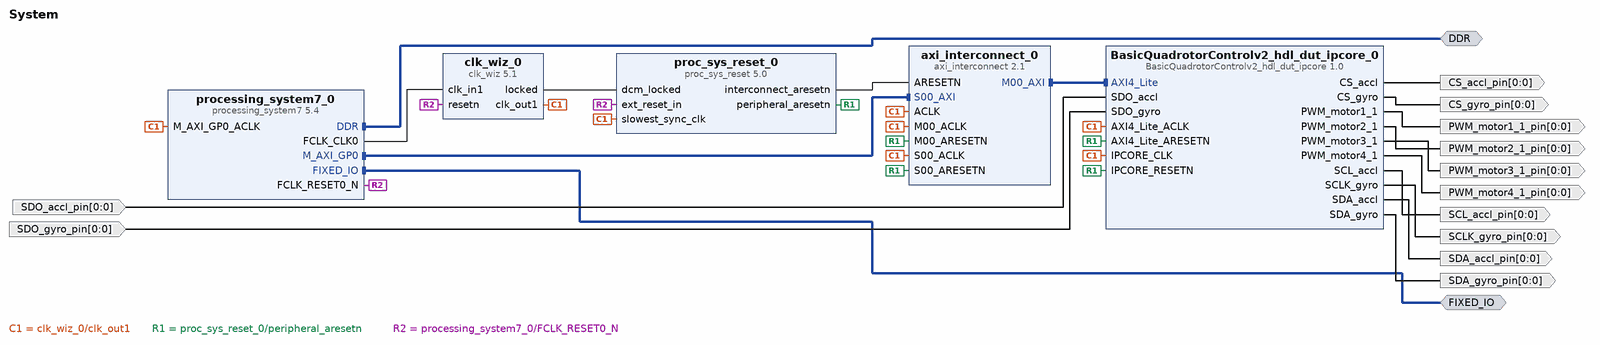
[diagram p0: block diagram of the top level]
# Vivado block design System, Vivado 2014.2
create_bd_design System

create_bd_intf_port -mode Master -vlnv xilinx.com:interface:ddrx_rtl:1.0 DDR
create_bd_intf_port -mode Master -vlnv xilinx.com:display_processing_system7:fixedio_rtl:1.0 FIXED_IO
create_bd_port -dir I -from 0 -to 0 SDO_accl_pin
create_bd_port -dir I -from 0 -to 0 SDO_gyro_pin
create_bd_port -dir O -from 0 -to 0 SCL_accl_pin
create_bd_port -dir O -from 0 -to 0 CS_accl_pin
create_bd_port -dir O -from 0 -to 0 SDA_accl_pin
create_bd_port -dir O -from 0 -to 0 SCLK_gyro_pin
create_bd_port -dir O -from 0 -to 0 CS_gyro_pin
create_bd_port -dir O -from 0 -to 0 SDA_gyro_pin
create_bd_port -dir O -from 0 -to 0 PWM_motor1_1_pin
create_bd_port -dir O -from 0 -to 0 PWM_motor2_1_pin
create_bd_port -dir O -from 0 -to 0 PWM_motor3_1_pin
create_bd_port -dir O -from 0 -to 0 PWM_motor4_1_pin

create_bd_cell -type ip -vlnv xilinx.com:ip:axi_interconnect:2.1 axi_interconnect_0
set_property -dict [list \
  CONFIG.NUM_MI 1 \
  CONFIG.ENABLE_ADVANCED_OPTIONS 0 \
  CONFIG.ENABLE_PROTOCOL_CHECKERS 0 \
] [get_bd_cells axi_interconnect_0]
create_bd_cell -type ip -vlnv xilinx.com:ip:clk_wiz:5.1 clk_wiz_0
set_property -dict {CONFIG.RESET_TYPE ACTIVE_LOW} [get_bd_cells clk_wiz_0]
create_bd_cell -type ip -vlnv xilinx.com:ip:proc_sys_reset:5.0 proc_sys_reset_0
create_bd_cell -type ip -vlnv xilinx.com:ip:processing_system7:5.4 processing_system7_0
set_property -dict {CONFIG.PCW_IMPORT_BOARD_PRESET MicroZed_7z020_RevB_v4.xml} [get_bd_cells processing_system7_0]
create_bd_cell -type ip -vlnv xilinx.com:ip:BasicQuadrotorControlv2_hdl_dut_ipcore:1.0 BasicQuadrotorControlv2_hdl_dut_ipcore_0

# ---- connections ----

connect_bd_intf_net [get_bd_intf_pins axi_interconnect_0/S00_AXI] [get_bd_intf_pins processing_system7_0/M_AXI_GP0]
connect_bd_intf_net [get_bd_intf_pins BasicQuadrotorControlv2_hdl_dut_ipcore_0/AXI4_Lite] [get_bd_intf_pins axi_interconnect_0/M00_AXI]
connect_bd_intf_net [get_bd_intf_ports DDR] [get_bd_intf_pins processing_system7_0/DDR]
connect_bd_intf_net [get_bd_intf_ports FIXED_IO] [get_bd_intf_pins processing_system7_0/FIXED_IO]
connect_bd_net [get_bd_pins clk_wiz_0/clk_out1] \
  [get_bd_pins axi_interconnect_0/ACLK] [get_bd_pins axi_interconnect_0/M00_ACLK] [get_bd_pins axi_interconnect_0/S00_ACLK] \
  [get_bd_pins proc_sys_reset_0/slowest_sync_clk] [get_bd_pins processing_system7_0/M_AXI_GP0_ACLK] \
  [get_bd_pins BasicQuadrotorControlv2_hdl_dut_ipcore_0/IPCORE_CLK] \
  [get_bd_pins BasicQuadrotorControlv2_hdl_dut_ipcore_0/AXI4_Lite_ACLK]
connect_bd_net [get_bd_pins clk_wiz_0/locked] [get_bd_pins proc_sys_reset_0/dcm_locked]
connect_bd_net [get_bd_pins proc_sys_reset_0/interconnect_aresetn] [get_bd_pins axi_interconnect_0/ARESETN]
connect_bd_net [get_bd_pins proc_sys_reset_0/peripheral_aresetn] \
  [get_bd_pins axi_interconnect_0/M00_ARESETN] [get_bd_pins axi_interconnect_0/S00_ARESETN] \
  [get_bd_pins BasicQuadrotorControlv2_hdl_dut_ipcore_0/IPCORE_RESETN] \
  [get_bd_pins BasicQuadrotorControlv2_hdl_dut_ipcore_0/AXI4_Lite_ARESETN]
connect_bd_net [get_bd_pins processing_system7_0/FCLK_CLK0] [get_bd_pins clk_wiz_0/clk_in1]
connect_bd_net [get_bd_pins processing_system7_0/FCLK_RESET0_N] [get_bd_pins clk_wiz_0/resetn] [get_bd_pins proc_sys_reset_0/ext_reset_in]
connect_bd_net [get_bd_ports SDO_accl_pin] [get_bd_pins BasicQuadrotorControlv2_hdl_dut_ipcore_0/SDO_accl]
connect_bd_net [get_bd_ports SDO_gyro_pin] [get_bd_pins BasicQuadrotorControlv2_hdl_dut_ipcore_0/SDO_gyro]
connect_bd_net [get_bd_pins BasicQuadrotorControlv2_hdl_dut_ipcore_0/SCL_accl] [get_bd_ports SCL_accl_pin]
connect_bd_net [get_bd_pins BasicQuadrotorControlv2_hdl_dut_ipcore_0/CS_accl] [get_bd_ports CS_accl_pin]
connect_bd_net [get_bd_pins BasicQuadrotorControlv2_hdl_dut_ipcore_0/SDA_accl] [get_bd_ports SDA_accl_pin]
connect_bd_net [get_bd_pins BasicQuadrotorControlv2_hdl_dut_ipcore_0/SCLK_gyro] [get_bd_ports SCLK_gyro_pin]
connect_bd_net [get_bd_pins BasicQuadrotorControlv2_hdl_dut_ipcore_0/CS_gyro] [get_bd_ports CS_gyro_pin]
connect_bd_net [get_bd_pins BasicQuadrotorControlv2_hdl_dut_ipcore_0/SDA_gyro] [get_bd_ports SDA_gyro_pin]
connect_bd_net [get_bd_pins BasicQuadrotorControlv2_hdl_dut_ipcore_0/PWM_motor1_1] [get_bd_ports PWM_motor1_1_pin]
connect_bd_net [get_bd_pins BasicQuadrotorControlv2_hdl_dut_ipcore_0/PWM_motor2_1] [get_bd_ports PWM_motor2_1_pin]
connect_bd_net [get_bd_pins BasicQuadrotorControlv2_hdl_dut_ipcore_0/PWM_motor3_1] [get_bd_ports PWM_motor3_1_pin]
connect_bd_net [get_bd_pins BasicQuadrotorControlv2_hdl_dut_ipcore_0/PWM_motor4_1] [get_bd_ports PWM_motor4_1_pin]

# ---- address map ----
assign_bd_address -offset 0x40010000 -range 64K -target_address_space [get_bd_addr_spaces processing_system7_0/Data] [get_bd_addr_segs BasicQuadrotorControlv2_hdl_dut_ipcore_0/AXI4_Lite/reg0]

validate_bd_design
save_bd_design
